# Altium project p0001.PrjPcb
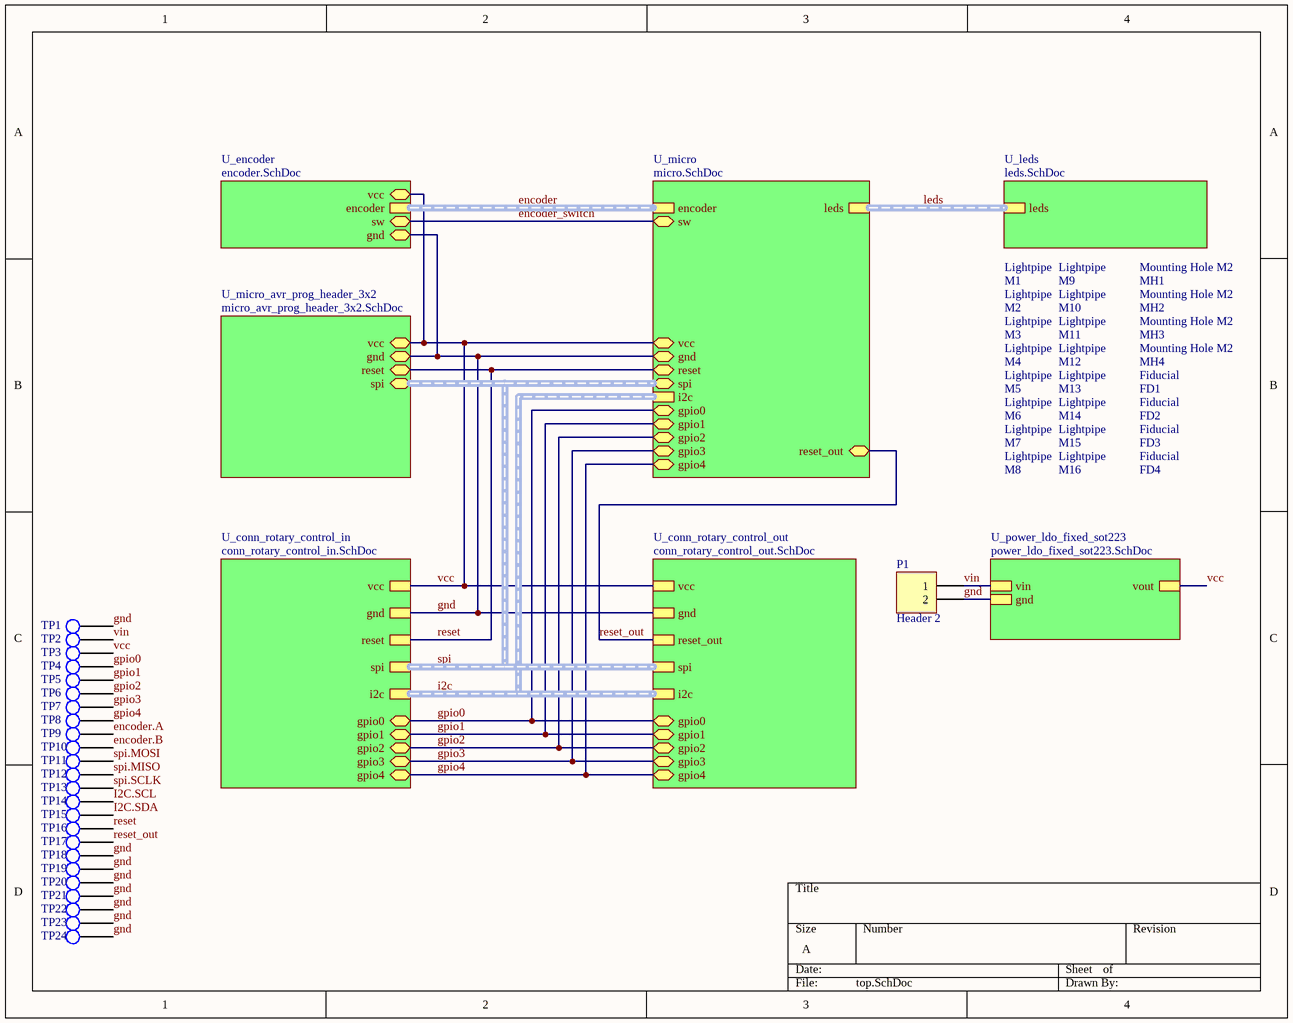
[diagram p0: top.SchDoc]
9 sheets, 97 parts. Net scope: strictly hierarchical (ports join the sheet entries above them; power ports are local).
Board file: PCB1.PcbDoc
Sheets:
  top.SchDoc
    U_encoder = encoder.SchDoc
    U_leds = leds.SchDoc
    U_micro = micro.SchDoc
      U_micro_avr_tiny_48_88_tqfp32 = micro_avr_tiny_48_88_tqfp32.SchDoc
    U_micro_avr_prog_header_3x2 = micro_avr_prog_header_3x2.SchDoc
    U_conn_rotary_control_in = conn_rotary_control_in.SchDoc
    U_conn_rotary_control_out = conn_rotary_control_out.SchDoc
    U_power_ldo_fixed_sot223 = power_ldo_fixed_sot223.SchDoc

## Sheet top.SchDoc
size A

### Parts
(Parts that share a designator on the sheet are numbered #1, #2 ... from top to bottom, then left to right.)
FD1  Component_1  [PCBComponent_1]  (value not drawn)
FD2  Component_1  [PCBComponent_1]  (value not drawn)
FD3  Component_1  [PCBComponent_1]  (value not drawn)
FD4  Component_1  [PCBComponent_1]  (value not drawn)
M1  Component_1  [PCBComponent_1]  (value not drawn)
M2  Component_1  [PCBComponent_1]  (value not drawn)
M3  Component_1  [PCBComponent_1]  (value not drawn)
M4  Component_1  [PCBComponent_1]  (value not drawn)
M5  Component_1  [PCBComponent_1]  (value not drawn)
M6  Component_1  [PCBComponent_1]  (value not drawn)
M7  Component_1  [PCBComponent_1]  (value not drawn)
M8  Component_1  [PCBComponent_1]  (value not drawn)
M9  Component_1  [PCBComponent_1]  (value not drawn)
M10  Component_1  [PCBComponent_1]  (value not drawn)
M11  Component_1  [PCBComponent_1]  (value not drawn)
M12  Component_1  [PCBComponent_1]  (value not drawn)
M13  Component_1  [PCBComponent_1]  (value not drawn)
M14  Component_1  [PCBComponent_1]  (value not drawn)
M15  Component_1  [PCBComponent_1]  (value not drawn)
M16  Component_1  [PCBComponent_1]  (value not drawn)
MH1  Component_1  [PCBComponent_1]  (value not drawn)
MH2  Component_1  [PCBComponent_1]  (value not drawn)
MH3  Component_1  [PCBComponent_1]  (value not drawn)
MH4  Component_1  [PCBComponent_1]  (value not drawn)
P1#1  Header 2  [HDR1X2]
TP1#1  Component_1  [PCBComponent_1]  (value not drawn)
TP2#1  Component_1  [PCBComponent_1]  (value not drawn)
TP3#1  Component_1  [PCBComponent_1]  (value not drawn)
TP4#1  Component_1  [PCBComponent_1]  (value not drawn)
TP5#1  Component_1  [PCBComponent_1]  (value not drawn)
TP6  Component_1  [PCBComponent_1]  (value not drawn)
TP7  Component_1  [PCBComponent_1]  (value not drawn)
TP8  Component_1  [PCBComponent_1]  (value not drawn)
TP9  Component_1  [PCBComponent_1]  (value not drawn)
TP10  Component_1  [PCBComponent_1]  (value not drawn)
TP11  Component_1  [PCBComponent_1]  (value not drawn)
TP12  Component_1  [PCBComponent_1]  (value not drawn)
TP13  Component_1  [PCBComponent_1]  (value not drawn)
TP14  Component_1  [PCBComponent_1]  (value not drawn)
TP15  Component_1  [PCBComponent_1]  (value not drawn)
TP16  Component_1  [PCBComponent_1]  (value not drawn)
TP17  Component_1  [PCBComponent_1]  (value not drawn)
TP18  Component_1  [PCBComponent_1]  (value not drawn)
TP19  Component_1  [PCBComponent_1]  (value not drawn)
TP20  Component_1  [PCBComponent_1]  (value not drawn)
TP21  Component_1  [PCBComponent_1]  (value not drawn)
TP22  Component_1  [PCBComponent_1]  (value not drawn)
TP23  Component_1  [PCBComponent_1]  (value not drawn)
TP24  Component_1  [PCBComponent_1]  (value not drawn)

### Sub-sheets
U_conn_rotary_control_in = conn_rotary_control_in.SchDoc: vcc, gnd, reset, spi (harness Spi_t), i2c (harness I2c_t), gpio0, gpio1, gpio2, gpio3, gpio4
U_conn_rotary_control_out = conn_rotary_control_out.SchDoc: vcc, gnd, reset_out, spi (harness Spi_t), i2c (harness I2c_t), gpio0, gpio1, gpio2, gpio3, gpio4
U_encoder = encoder.SchDoc: encoder (harness encoder_t), gnd, sw, vcc
U_leds = leds.SchDoc: leds (harness Array_4x4_t)
U_micro = micro.SchDoc: leds (harness Array_4x4_t), encoder (harness Encoder_t), i2c (harness i2c_t), vcc, gnd, reset, spi (harness Spi_t), reset_out, gpio0, gpio1, gpio2, gpio3, gpio4, sw
U_micro_avr_prog_header_3x2 = micro_avr_prog_header_3x2.SchDoc: vcc, reset, gnd, spi (harness Spi_t)
U_power_ldo_fixed_sot223 = power_ldo_fixed_sot223.SchDoc: gnd, vin, vout

### Nets
encoder.A: TP9.1
encoder.B: TP10.1
encoder_switch: sheet U_encoder/sw, sheet U_micro/sw
gnd: P1#1.2 TP1#1.1 TP18.1 TP19.1 TP20.1 TP21.1 TP22.1 TP23.1 TP24.1 ; sheet U_encoder/gnd, sheet U_micro/gnd, sheet U_micro_avr_prog_header_3x2/gnd, sheet U_conn_rotary_control_in/gnd, sheet U_conn_rotary_control_out/gnd, sheet U_power_ldo_fixed_sot223/gnd
gpio0: TP4#1.1 ; sheet U_micro/gpio0, sheet U_conn_rotary_control_in/gpio0, sheet U_conn_rotary_control_out/gpio0
gpio1: TP5#1.1 ; sheet U_micro/gpio1, sheet U_conn_rotary_control_in/gpio1, sheet U_conn_rotary_control_out/gpio1
gpio2: TP6.1 ; sheet U_micro/gpio2, sheet U_conn_rotary_control_in/gpio2, sheet U_conn_rotary_control_out/gpio2
gpio3: TP7.1 ; sheet U_micro/gpio3, sheet U_conn_rotary_control_in/gpio3, sheet U_conn_rotary_control_out/gpio3
gpio4: TP8.1 ; sheet U_micro/gpio4, sheet U_conn_rotary_control_in/gpio4, sheet U_conn_rotary_control_out/gpio4
I2C.SCL: TP14.1
I2C.SDA: TP15.1
reset: TP16.1 ; sheet U_micro/reset, sheet U_micro_avr_prog_header_3x2/reset, sheet U_conn_rotary_control_in/reset
reset_out: TP17.1 ; sheet U_micro/reset_out, sheet U_conn_rotary_control_out/reset_out
spi.MISO: TP12.1
spi.MOSI: TP11.1
spi.SCLK: TP13.1
vcc: TP3#1.1 ; sheet U_encoder/vcc, sheet U_micro/vcc, sheet U_micro_avr_prog_header_3x2/vcc, sheet U_conn_rotary_control_in/vcc, sheet U_conn_rotary_control_out/vcc, sheet U_power_ldo_fixed_sot223/vout
vin: P1#1.1 TP2#1.1 ; sheet U_power_ldo_fixed_sot223/vin

### Buses and harness runs
harness encoder = sheet U_encoder/encoder = sheet U_micro/encoder
harness i2c = sheet U_conn_rotary_control_in/i2c = sheet U_conn_rotary_control_out/i2c = sheet U_micro/i2c
harness leds = sheet U_leds/leds = sheet U_micro/leds
harness spi = sheet U_conn_rotary_control_in/spi = sheet U_conn_rotary_control_out/spi = sheet U_micro/spi = sheet U_micro_avr_prog_header_3x2/spi

### Notes on the sheet
- (in symbol Component_1) Lightpipe; Mounting Hole M2; Fiducial

### Library data of the parts
M1-M16 = Component_1: Light Pipe Vertical; ManufacturerPartNumber: VLP-350-F; Manufacturer: Bivar
P1#1 = Header 2: Header, 2-Pin; LatestRevisionDate: 17-Jul-2002; LatestRevisionNote: Re-released for DXP Platform.; Publisher: Altium Limited

## Sheet encoder.SchDoc
size A
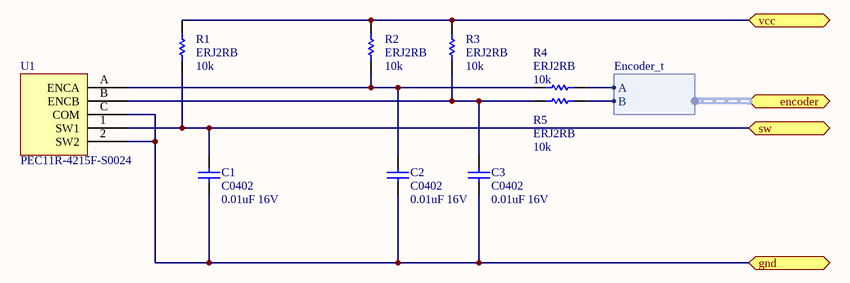
[diagram p1: encoder.SchDoc]

### Parts
(Parts that share a designator on the sheet are numbered #1, #2 ... from top to bottom, then left to right.)
C1#1  C0402  value 0.01uF 16V  [0402]
C2#1  C0402  value 0.01uF 16V  [0402]
C3#1  C0402  value 0.01uF 16V  [0402]
R1#1  ERJ2RB  value 10k  [2-0402]
R2#1  ERJ2RB  value 10k  [2-0402]
R3#1  ERJ2RB  value 10k  [2-0402]
R4#1  ERJ2RB  value 10k  [2-0402]
R5  ERJ2RB  value 10k  [2-0402]
U1#1  PEC11R-4215F-S0024  [PCBComponent_1]

### Ports
encoder (harness Encoder_t), gnd, sw, vcc

### Harnesses
Encoder_t: A, B

### Nets
encoder.A: R4#1.1 ; port encoder.A
encoder.B: R5.1 ; port encoder.B
encoder_switch: C1#1.1 R1#1.1 U1#1.1(SW1) ; port sw
gnd: C1#1.2 C2#1.2 C3#1.2 U1#1.2(SW2) U1#1.C(COM) ; port gnd
vcc: R1#1.2 R2#1.2 R3#1.2 ; port vcc
NetC2#1_1: C2#1.1 R2#1.1 R4#1.2 U1#1.A(ENCA)
NetC3#1_1: C3#1.1 R3#1.1 R5.2 U1#1.B(ENCB)

### Library data of the parts
C1#1 C2#1 C3#1 = C0402: Ceramic Chip Capacitor - Standard; Note: Footprint corresponds to dimensions for bulk cassette packaging. This case size has tightened tolerances.; Published: 17-Jul-2002; LatestRevisionDate: 19-Mar-2004; LatestRevisionNote: Silkscreen size reduced.; DatasheetDocument: Mar-2001; PackageDocument: Mar-2001; PackageReference: 0402; Publisher: Altium Limited; Code_JEITA: 0402; Code_IPC: 1005 [0402]; ComponentLink1Description: Manufacturer Link; ComponentLink1URL: http://www.kemet.com/; ComponentLink2Description: Datasheet; ComponentLink2URL: http://www.kemet.com/kemet/web/homepage/kechome.nsf/vapubfilesname/F3102TA.pdf/$file/F3102TA.pdf
R1#1 R2#1 R3#1 R4#1 R5 = ERJ2RB: Precision Thick Film Chip Resistor, 10 Ohm to 1M Ohm Range, 1% and 0.5% Tolerance, 0402 Size, 0.063 W; Published: 17-Dec-2003; LatestRevisionDate: 19-Mar-2004; LatestRevisionNote: Silkscreen size reduced.; PackageDocument: Mar-2003; PackageReference: 2-0402; Publisher: Altium Limited; Code_IPC: 1005 [0402]; ComponentLink1Description: Manufacturer Link; ComponentLink1URL: http://www.panasonic.com/industrial/components/resistive_products.htm; ComponentLink2Description: Datasheet; ComponentLink2URL: http://www.panasonic.com/industrial/components/pdf/AOA0000CE2.pdf
U1#1 = Component_1: PEC11R-4xxxF-Sxxxx; Manufacturer: Bourns; ManufacturerPartNumber: PEC11R-4215F-S0024

## Sheet leds.SchDoc
size A
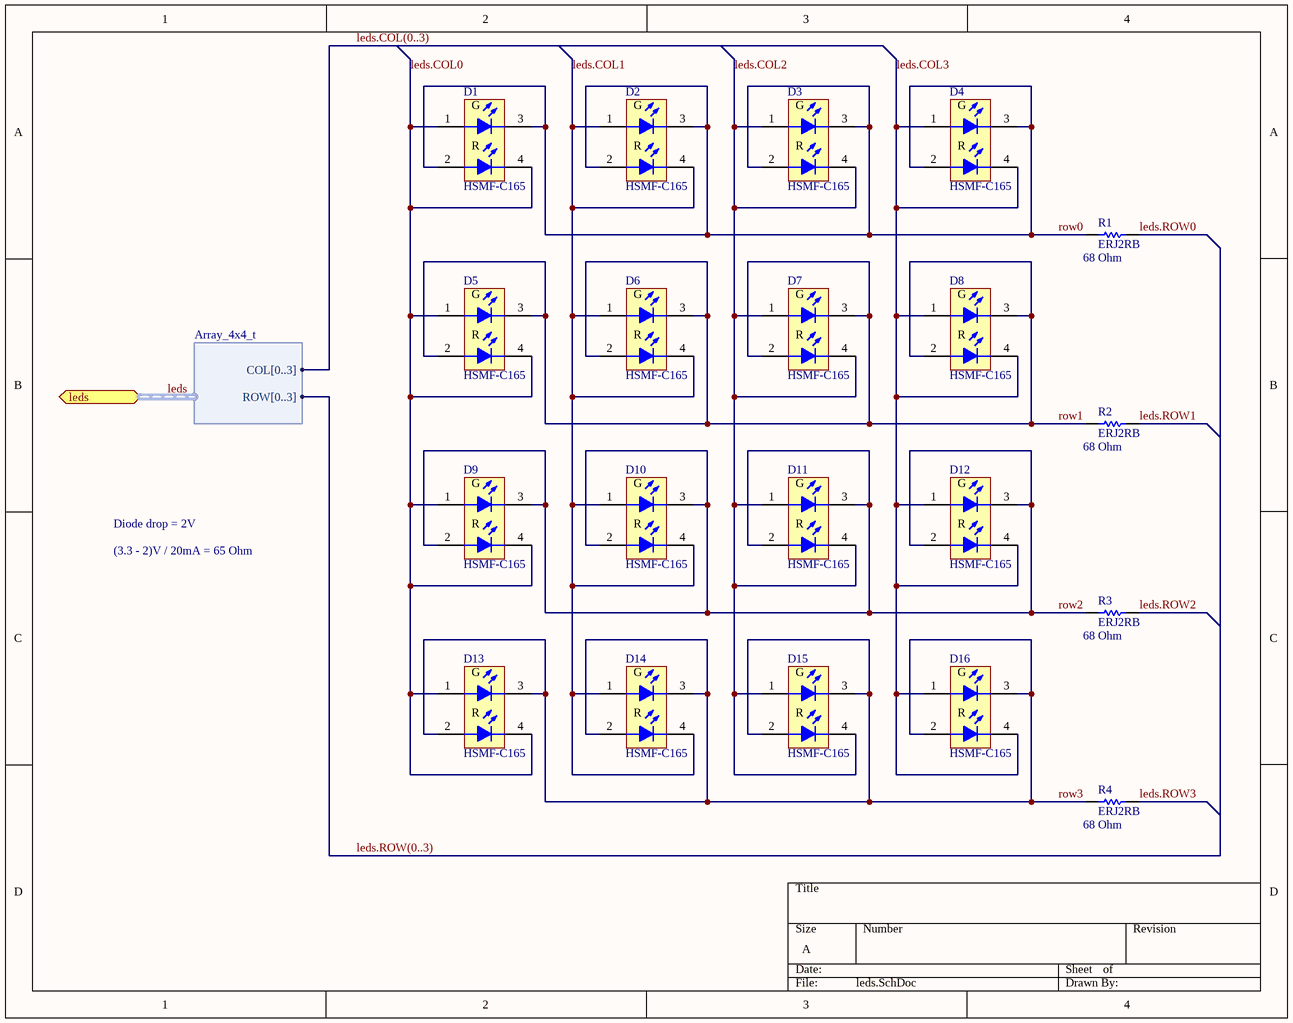
[diagram p2: leds.SchDoc]

### Parts
(Parts that share a designator on the sheet are numbered #1, #2 ... from top to bottom, then left to right.)
D1  HSMF-C165  [1.6X0.8X0.5]
D2  HSMF-C165  [1.6X0.8X0.5]
D3  HSMF-C165  [1.6X0.8X0.5]
D4  HSMF-C165  [1.6X0.8X0.5]
D5  HSMF-C165  [1.6X0.8X0.5]
D6  HSMF-C165  [1.6X0.8X0.5]
D7  HSMF-C165  [1.6X0.8X0.5]
D8  HSMF-C165  [1.6X0.8X0.5]
D9  HSMF-C165  [1.6X0.8X0.5]
D10  HSMF-C165  [1.6X0.8X0.5]
D11  HSMF-C165  [1.6X0.8X0.5]
D12  HSMF-C165  [1.6X0.8X0.5]
D13  HSMF-C165  [1.6X0.8X0.5]
D14  HSMF-C165  [1.6X0.8X0.5]
D15  HSMF-C165  [1.6X0.8X0.5]
D16  HSMF-C165  [1.6X0.8X0.5]
R1#2  ERJ2RB  value 68 Ohm  [2-0402]
R2#2  ERJ2RB  value 68 Ohm  [2-0402]
R3#2  ERJ2RB  value 68 Ohm  [2-0402]
R4#2  ERJ2RB  value 68 Ohm  [2-0402]

### Ports
leds (harness Array_4x4_t)

### Harnesses
Array_4x4_t: ROW[0..3], COL[0..3]

### Nets
leds.COL0: D1.1(A1) D1.4(K2) D5.1(A1) D5.4(K2) D9.1(A1) D9.4(K2) D13.1(A1) D13.4(K2)
leds.COL1: D2.1(A1) D2.4(K2) D6.1(A1) D6.4(K2) D10.1(A1) D10.4(K2) D14.1(A1) D14.4(K2)
leds.COL2: D3.1(A1) D3.4(K2) D7.1(A1) D7.4(K2) D11.1(A1) D11.4(K2) D15.1(A1) D15.4(K2)
leds.COL3: D4.1(A1) D4.4(K2) D8.1(A1) D8.4(K2) D12.1(A1) D12.4(K2) D16.1(A1) D16.4(K2)
leds.ROW0: R1#2.1
leds.ROW1: R2#2.1
leds.ROW2: R3#2.1
leds.ROW3: R4#2.1
row0: D1.2(A2) D1.3(K1) D2.2(A2) D2.3(K1) D3.2(A2) D3.3(K1) D4.2(A2) D4.3(K1) R1#2.2
row1: D5.2(A2) D5.3(K1) D6.2(A2) D6.3(K1) D7.2(A2) D7.3(K1) D8.2(A2) D8.3(K1) R2#2.2
row2: D9.2(A2) D9.3(K1) D10.2(A2) D10.3(K1) D11.2(A2) D11.3(K1) D12.2(A2) D12.3(K1) R3#2.2
row3: D13.2(A2) D13.3(K1) D14.2(A2) D14.3(K1) D15.2(A2) D15.3(K1) D16.2(A2) D16.3(K1) R4#2.2

### Buses and harness runs
bus leds.COL(0..3)
bus leds.ROW(0..3)
harness leds = port leds

### Notes on the sheet
- Diode drop = 2V
- (3.3 - 2)V / 20mA = 65 Ohm
- (in symbol HSMF-C165) G; R

### Library data of the parts
D1-D16 = HSMF-C165: Miniature Bi-Colour Surface Mount Chip LED (Red/Green); LuminousIntensity: 2.5mcd (Minimum).; LED_Colour: Red & Green; PCB_Layout: Complies with manufacturer's recommendation.; Published: 11-Dec-2002; DatasheetVersion: 6-Apr-2002; PackageVersion: 6-Apr-2002; PackageReference: 1.6X0.8X0.5; Publisher: Altium Limited; PackageDescription: SM LED, Bi-Colour; 4 Flat Leads; Body 1.6 x 0.8 x 0.5 mm (LxWxH); ComponentLink1Description: Manufacturer Link; ComponentLink1URL: http://www.avagotech.com/; ComponentLink2Description: Datasheet; ComponentLink2URL: http://cp.literature.agilent.com/litweb/pdf/5988-6146EN.pdf
R1#2 R2#2 R3#2 R4#2 = ERJ2RB: as R1#1 on sheet encoder; Published: 17-Dec-2003; LatestRevisionDate: 19-Mar-2004; LatestRevisionNote: Silkscreen size reduced.; PackageDocument: Mar-2003; PackageReference: 2-0402; Publisher: Altium Limited; Code_IPC: 1005 [0402]; ComponentLink1Description: Manufacturer Link; ComponentLink1URL: http://www.panasonic.com/industrial/components/resistive_products.htm; ComponentLink2Description: Datasheet; ComponentLink2URL: http://www.panasonic.com/industrial/components/pdf/AOA0000CE2.pdf

## Sheet micro.SchDoc
size A
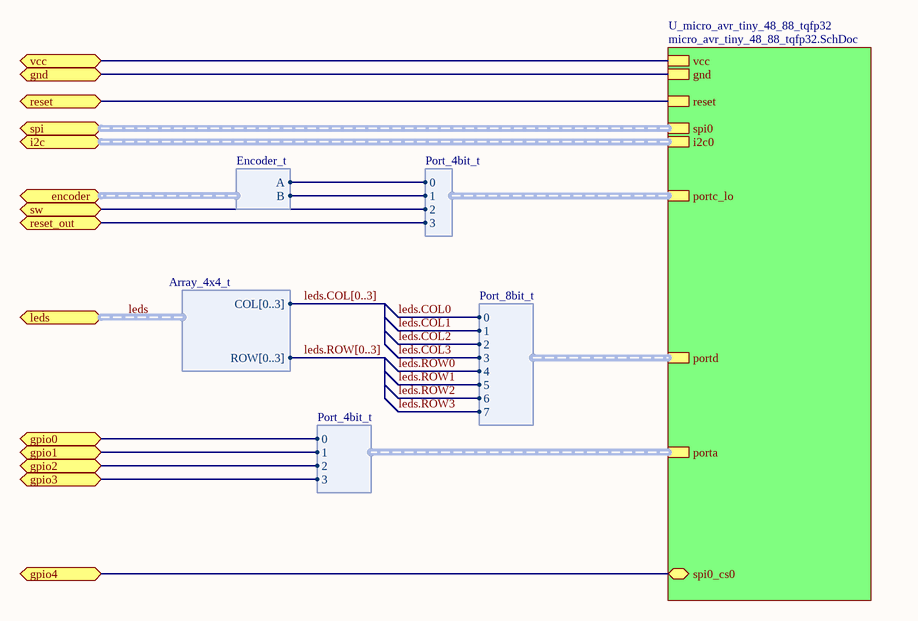
[diagram p3: micro.SchDoc]

### Sub-sheets
U_micro_avr_tiny_48_88_tqfp32 = micro_avr_tiny_48_88_tqfp32.SchDoc: vcc, gnd, spi0 (harness Spi_t), reset, portc_lo (harness Port_4bit_t), i2c0 (harness I2c_t), portd (harness Port_8bit_t), porta (harness Port_4bit_t), spi0_cs0

### Ports
encoder (harness Encoder_t), gnd, gpio0, gpio1, gpio2, gpio3, gpio4, i2c (harness i2c_t), leds (harness Array_4x4_t), reset, reset_out, spi (harness Spi_t), sw, vcc

### Harnesses
Encoder_t: A, B
Port_4bit_t: 0, 1, 2, 3
Port_8bit_t: 0, 1, 2, 3, 4, 5, 6, 7
Array_4x4_t: COL[0..3], ROW[0..3]

### Nets
encoder.A: port encoder.A, sheet U_micro_avr_tiny_48_88_tqfp32/portc_lo.0
encoder.B: port encoder.B, sheet U_micro_avr_tiny_48_88_tqfp32/portc_lo.1
encoder_switch: port sw, sheet U_micro_avr_tiny_48_88_tqfp32/portc_lo.2
gnd: port gnd, sheet U_micro_avr_tiny_48_88_tqfp32/gnd
gpio0: port gpio0, sheet U_micro_avr_tiny_48_88_tqfp32/porta.0
gpio1: port gpio1, sheet U_micro_avr_tiny_48_88_tqfp32/porta.1
gpio2: port gpio2, sheet U_micro_avr_tiny_48_88_tqfp32/porta.2
gpio3: port gpio3, sheet U_micro_avr_tiny_48_88_tqfp32/porta.3
gpio4: port gpio4, sheet U_micro_avr_tiny_48_88_tqfp32/spi0_cs0
reset: port reset, sheet U_micro_avr_tiny_48_88_tqfp32/reset
reset_out: port reset_out, sheet U_micro_avr_tiny_48_88_tqfp32/portc_lo.3
vcc: port vcc, sheet U_micro_avr_tiny_48_88_tqfp32/vcc

### Buses and harness runs
bus leds.COL[0..3]
bus leds.ROW[0..3]
harness leds = port leds
harness port i2c = sheet U_micro_avr_tiny_48_88_tqfp32/i2c0
harness port spi = sheet U_micro_avr_tiny_48_88_tqfp32/spi0

## Sheet micro_avr_tiny_48_88_tqfp32.SchDoc
size A
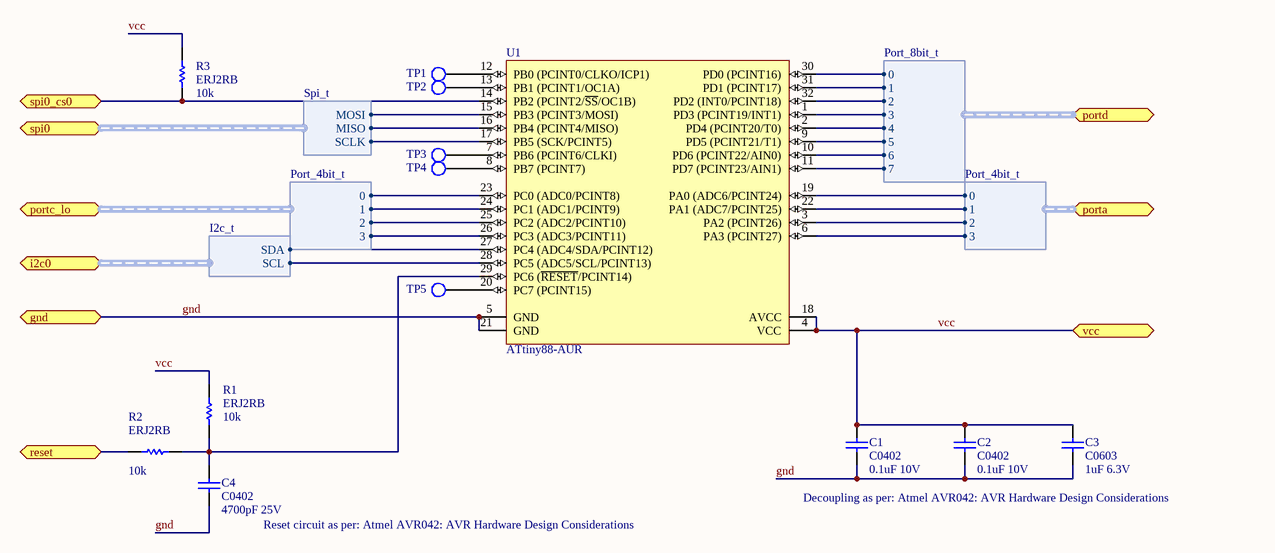
[diagram p4: micro_avr_tiny_48_88_tqfp32.SchDoc]

### Parts
(Parts that share a designator on the sheet are numbered #1, #2 ... from top to bottom, then left to right.)
C1#2  C0402  value 0.1uF 10V  [0402]
C2#2  C0402  value 0.1uF 10V  [0402]
C3#2  C0603  value 1uF 6.3V  [0603]
C4  C0402  value 4700pF 25V  [0402]
R1#3  ERJ2RB  value 10k  [2-0402]
R2#3  ERJ2RB  value 10k  [2-0402]
R3#3  ERJ2RB  value 10k  [2-0402]
TP1#2  Component_1  [PCBComponent_1]  (value not drawn)
TP2#2  Component_1  [PCBComponent_1]  (value not drawn)
TP3#2  Component_1  [PCBComponent_1]  (value not drawn)
TP4#2  Component_1  [PCBComponent_1]  (value not drawn)
TP5#2  Component_1  [PCBComponent_1]  (value not drawn)
U1#2  ATtiny88-AUR  [32A_N]

### Ports
gnd, i2c0 (harness I2c_t), porta (harness Port_4bit_t), portc_lo (harness Port_4bit_t), portd (harness Port_8bit_t), reset, spi0 (harness Spi_t), spi0_cs0, vcc

### Harnesses
Port_4bit_t: 0, 1, 2, 3
I2c_t: SDA, SCL
Port_8bit_t: 0, 1, 2, 3, 4, 5, 6, 7
Spi_t: MISO, MOSI, SCLK

### Nets
encoder.A: U1#2.23(PC0_(ADC0/PCINT8)) ; port portc_lo.0
encoder.B: U1#2.24(PC1_(ADC1/PCINT9)) ; port portc_lo.1
encoder_switch: U1#2.25(PC2_(ADC2/PCINT10)) ; port portc_lo.2
gnd: C1#2.2 C2#2.2 C3#2.1 C4.2 U1#2.5(GND) U1#2.21(GND) ; port gnd
gpio0: U1#2.19(PA0_(ADC6/PCINT24)) ; port porta.0
gpio1: U1#2.22(PA1_(ADC7/PCINT25)) ; port porta.1
gpio2: U1#2.3(PA2_(PCINT26)) ; port porta.2
gpio3: U1#2.6(PA3_(PCINT27)) ; port porta.3
gpio4: R3#3.1 U1#2.14(PB2_(PCINT2/~{SS}/OC1B)) ; port spi0_cs0
i2c.SCL: U1#2.28(PC5_(ADC5/SCL/PCINT13)) ; port i2c0.SCL
i2c.SDA: U1#2.27(PC4_(ADC4/SDA/PCINT12)) ; port i2c0.SDA
leds.COL0: U1#2.30(PD0_(PCINT16)) ; port portd.0
leds.COL1: U1#2.31(PD1_(PCINT17)) ; port portd.1
leds.COL2: U1#2.32(PD2_(INT0/PCINT18)) ; port portd.2
leds.COL3: U1#2.1(PD3_(PCINT19/INT1)) ; port portd.3
leds.ROW0: U1#2.2(PD4_(PCINT20/T0)) ; port portd.4
leds.ROW1: U1#2.9(PD5_(PCINT21/T1)) ; port portd.5
leds.ROW2: U1#2.10(PD6_(PCINT22/AIN0)) ; port portd.6
leds.ROW3: U1#2.11(PD7_(PCINT23/AIN1)) ; port portd.7
reset: R2#3.2 ; port reset
reset_out: U1#2.26(PC3_(ADC3/PCINT11)) ; port portc_lo.3
spi.MISO: U1#2.16(PB4_(PCINT4/MISO)) ; port spi0.MISO
spi.MOSI: U1#2.15(PB3_(PCINT3/MOSI)) ; port spi0.MOSI
spi.SCLK: U1#2.17(PB5_(SCK/PCINT5)) ; port spi0.SCLK
vcc: C1#2.1 C2#2.1 C3#2.2 R1#3.2 R3#3.2 U1#2.4(VCC) U1#2.18(AVCC) ; port vcc
NetC4_1: C4.1 R1#3.1 R2#3.1 U1#2.29(PC6_(~{RESET}/PCINT14))
NetTP1#2_1: TP1#2.1 U1#2.12(PB0_(PCINT0/CLKO/ICP1))
NetTP2#2_1: TP2#2.1 U1#2.13(PB1_(PCINT1/OC1A))
NetTP3#2_1: TP3#2.1 U1#2.7(PB6_(PCINT6/CLKI))
NetTP4#2_1: TP4#2.1 U1#2.8(PB7_(PCINT7))
NetTP5#2_1: TP5#2.1 U1#2.20(PC7_(PCINT15))

### Notes on the sheet
- Decoupling as per: Atmel AVR042: AVR Hardware Design Considerations
- Reset circuit as per: Atmel AVR042: AVR Hardware Design Considerations

### Library data of the parts
C1#2 C2#2 C4 = C0402: as C1#1 on sheet encoder; Published: 17-Jul-2002; LatestRevisionDate: 19-Mar-2004; LatestRevisionNote: Silkscreen size reduced.; DatasheetDocument: Mar-2001; PackageDocument: Mar-2001; PackageReference: 0402; Publisher: Altium Limited; Code_JEITA: 0402; Code_IPC: 1005 [0402]; ComponentLink1Description: Manufacturer Link; ComponentLink1URL: http://www.kemet.com/; ComponentLink2Description: Datasheet; ComponentLink2URL: http://www.kemet.com/kemet/web/homepage/kechome.nsf/vapubfilesname/F3102TA.pdf/$file/F3102TA.pdf
C3#2 = C0603: Ceramic Chip Capacitor - Standard; Note: Footprint corresponds to dimensions for bulk cassette packaging. This case size has tightened tolerances.; Published: 17-Jul-2002; LatestRevisionDate: 19-Mar-2004; LatestRevisionNote: Silkscreen size reduced.; DatasheetDocument: Mar-2001; PackageDocument: Mar-2001; PackageReference: 0603; Publisher: Altium Limited; Code_JEITA: 0603; Code_IPC: 1608 [0603]; ComponentLink1Description: Manufacturer Link; ComponentLink1URL: http://www.kemet.com/; ComponentLink2Description: Datasheet; ComponentLink2URL: http://www.kemet.com/kemet/web/homepage/kechome.nsf/vapubfilesname/F3102TA.pdf/$file/F3102TA.pdf
R1#3 R2#3 R3#3 = ERJ2RB: as R1#1 on sheet encoder; Published: 17-Dec-2003; LatestRevisionDate: 19-Mar-2004; LatestRevisionNote: Silkscreen size reduced.; PackageDocument: Mar-2003; PackageReference: 2-0402; Publisher: Altium Limited; Code_IPC: 1005 [0402]; ComponentLink1Description: Manufacturer Link; ComponentLink1URL: http://www.panasonic.com/industrial/components/resistive_products.htm; ComponentLink2Description: Datasheet; ComponentLink2URL: http://www.panasonic.com/industrial/components/pdf/AOA0000CE2.pdf
U1#2 = ATtiny88-AUR: 8-bit AVR Microcontroller, 1.8-5.5V, 12MHz, 8KB Flash, 64 Bytes EEPROM, 512 Bytes SRAM, 32-pin TQFP, Industrial Grade (-40°C to 85°C), Pb-Free, Reel; DatasheetVersion: revC, Mar-2009; PackageVersion: revC, Oct-2010; PackageReference: 32A; PackageDescription: 32-Lead, 7x7x1.0 mm Body, 0.8mm Lead Pitch, Thin Profile Plastic Quad Flat Package (TQFP); Code_JEDEC: MS-026-ABA; ComponentLink1Description: Manufacturer URL; ComponentLink1URL: http://www.atmel.com/; ComponentLink2Description: ATtiny48/88 Datasheet; ComponentLink2URL: http://www.atmel.com/dyn/resources/prod_documents/doc8008.pdf; ComponentLink3Description: ATtiny48/88 Summary; ComponentLink3URL: http://www.atmel.com/dyn/resources/prod_documents/8008S.pdf

## Sheet micro_avr_prog_header_3x2.SchDoc
size A
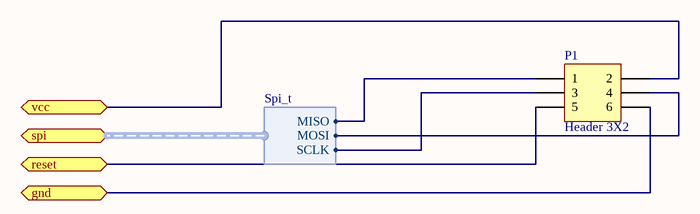
[diagram p5: micro_avr_prog_header_3x2.SchDoc]

### Parts
(Parts that share a designator on the sheet are numbered #1, #2 ... from top to bottom, then left to right.)
P1#2  Header 3X2  [HDR2X3]

### Ports
gnd, reset, spi (harness Spi_t), vcc

### Harnesses
Spi_t: MISO, MOSI, SCLK

### Nets
gnd: P1#2.6 ; port gnd
reset: P1#2.5 ; port reset
spi.MISO: P1#2.1 ; port spi.MISO
spi.MOSI: P1#2.4 ; port spi.MOSI
spi.SCLK: P1#2.3 ; port spi.SCLK
vcc: P1#2.2 ; port vcc

### Library data of the parts
P1#2 = Header 3X2: Header, 3-Pin, Dual row; LatestRevisionDate: 17-Jul-2002; LatestRevisionNote: Re-released for DXP Platform.; Publisher: Altium Limited

## Sheet conn_rotary_control_in.SchDoc
size A
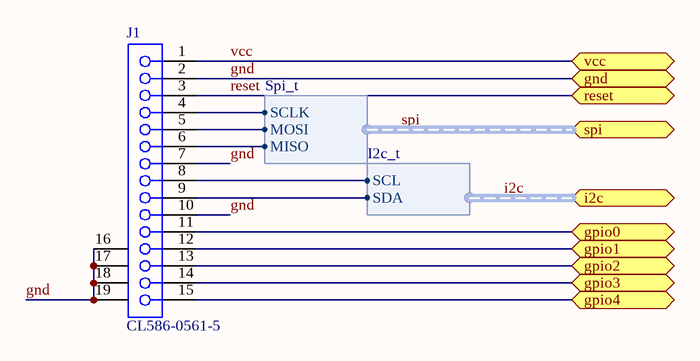
[diagram p6: conn_rotary_control_in.SchDoc]

### Parts
(Parts that share a designator on the sheet are numbered #1, #2 ... from top to bottom, then left to right.)
J1#1  CL586-0561-5  [FH12-15S-0.5SV]

### Ports
gnd, gpio0, gpio1, gpio2, gpio3, gpio4, i2c (harness I2c_t), reset, spi (harness Spi_t), vcc

### Harnesses
Spi_t: MISO, MOSI, SCLK
I2c_t: SCL, SDA

### Nets
gnd: J1#1.2 J1#1.7 J1#1.10 J1#1.16(MH1) J1#1.17(MH2) J1#1.18(MH3) J1#1.19(MH4) ; port gnd
gpio0: J1#1.11 ; port gpio0
gpio1: J1#1.12 ; port gpio1
gpio2: J1#1.13 ; port gpio2
gpio3: J1#1.14 ; port gpio3
gpio4: J1#1.15 ; port gpio4
i2c.SCL: J1#1.8 ; port i2c.SCL
i2c.SDA: J1#1.9 ; port i2c.SDA
reset: J1#1.3 ; port reset
spi.MISO: J1#1.6 ; port spi.MISO
spi.MOSI: J1#1.5 ; port spi.MOSI
spi.SCLK: J1#1.4 ; port spi.SCLK
vcc: J1#1.1 ; port vcc

### Buses and harness runs
harness i2c = port i2c
harness spi = port spi

### Library data of the parts
J1#1 = CL586-0561-5: FH12 Series, "Flip-Lock" SMT/ZIF FFC/FPC Connector - 0.5mm Spaced Vertical Mounting; Manufacturer: Hirose; ManufacturerPartNumber: FH12-15S-0.5SV(55); Positions: 15; ContactMaterial: Phosphor Bronze; Current: 0.4A; PCB_Layout: Complies with manufacturer's recommendation.; Note: Pad dimensions follow nominal values, Suitable for Wave Soldering, Adjust for Re-flow.; Published: 17-Jul-2002; DatasheetVersion: 13-Nov-2000; PackageVersion: 13-Nov-2000; PackageReference: FH12-15S-0.5SV; Publisher: Altium Limited; ComponentLink1Description: Manufacturer Link; ComponentLink1URL: http://www.hiroseusa.com/; ComponentLink2Description: Datasheet; ComponentLink2URL: http://www.hirose.co.jp/cataloge_hp/e58605370.pdf

## Sheet conn_rotary_control_out.SchDoc
size A
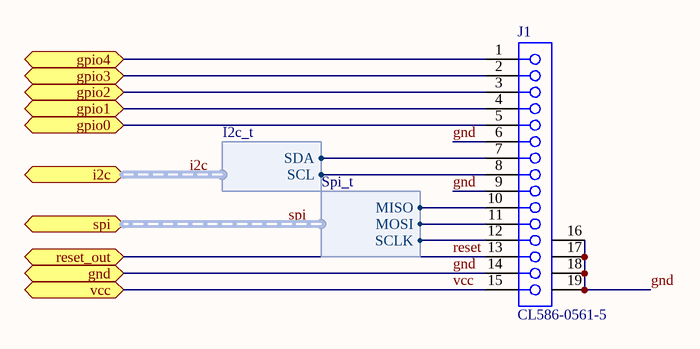
[diagram p7: conn_rotary_control_out.SchDoc]

### Parts
(Parts that share a designator on the sheet are numbered #1, #2 ... from top to bottom, then left to right.)
J1#2  CL586-0561-5  [FH12-15S-0.5SV]

### Ports
gnd, gpio0, gpio1, gpio2, gpio3, gpio4, i2c (harness I2c_t), reset_out, spi (harness Spi_t), vcc

### Harnesses
Spi_t: MISO, MOSI, SCLK
I2c_t: SCL, SDA

### Nets
gnd: J1#2.6 J1#2.9 J1#2.14 J1#2.16(MH1) J1#2.17(MH2) J1#2.18(MH3) J1#2.19(MH4) ; port gnd
gpio0: J1#2.5 ; port gpio0
gpio1: J1#2.4 ; port gpio1
gpio2: J1#2.3 ; port gpio2
gpio3: J1#2.2 ; port gpio3
gpio4: J1#2.1 ; port gpio4
i2c.SCL: J1#2.8 ; port i2c.SCL
i2c.SDA: J1#2.7 ; port i2c.SDA
reset: J1#2.13 ; port reset_out  [project net reset_out]
spi.MISO: J1#2.10 ; port spi.MISO
spi.MOSI: J1#2.11 ; port spi.MOSI
spi.SCLK: J1#2.12 ; port spi.SCLK
vcc: J1#2.15 ; port vcc

### Buses and harness runs
harness i2c = port i2c
harness spi = port spi

### Library data of the parts
J1#2 = CL586-0561-5: as J1#1 on sheet conn_rotary_control_in; Published: 17-Jul-2002; DatasheetVersion: 13-Nov-2000; PackageVersion: 13-Nov-2000; PackageReference: FH12-15S-0.5SV; Publisher: Altium Limited; ComponentLink1Description: Manufacturer Link; ComponentLink1URL: http://www.hiroseusa.com/; ComponentLink2Description: Datasheet; ComponentLink2URL: http://www.hirose.co.jp/cataloge_hp/e58605370.pdf

## Sheet power_ldo_fixed_sot223.SchDoc
size A
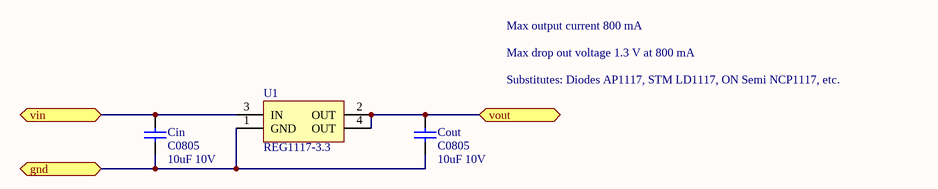
[diagram p8: power_ldo_fixed_sot223.SchDoc]

### Parts
(Parts that share a designator on the sheet are numbered #1, #2 ... from top to bottom, then left to right.)
Cin  C0805  value 10uF 10V  [0805]
Cout  C0805  value 10uF 10V  [0805]
U1#3  REG1117-3.3  [ZZ311]

### Ports
gnd, vin, vout

### Nets
gnd: Cin.2 Cout.2 U1#3.1(GND) ; port gnd
vcc: Cout.1 U1#3.2(OUT) U1#3.4(OUT) ; port vout
vin: Cin.1 U1#3.3(IN) ; port vin

### Notes on the sheet
- Max drop out voltage 1.3 V at 800 mA
- Max output current 800 mA
- Substitutes: Diodes AP1117, STM LD1117, ON Semi NCP1117, etc.

### Library data of the parts
Cin Cout = C0805: Ceramic Chip Capacitor - Standard; Note: Footprint corresponds to dimensions for bulk cassette packaging. This case size has tightened tolerances.; Published: 17-Jul-2002; LatestRevisionDate: 19-Mar-2004; LatestRevisionNote: Silkscreen size reduced.; DatasheetDocument: Mar-2001; PackageDocument: Mar-2001; PackageReference: 0805; Publisher: Altium Limited; Code_JEITA: 0805; Code_IPC: 2012[0805]; ComponentLink1Description: Manufacturer Link; ComponentLink1URL: http://www.kemet.com/; ComponentLink2Description: Datasheet; ComponentLink2URL: http://www.kemet.com/kemet/web/homepage/kechome.nsf/vapubfilesname/F3102TA.pdf/$file/F3102TA.pdf
U1#3 = REG1117-3.3: 800mA and 1A Low Dropout Positive Regulator 2.85V, 3.3V, 5V, and Adjustable; Manufacturer: Texas Instruments; ManufacturerPartNumber: REG1117-3.3/2K5; Published: 8-Jun-2000; LatestRevisionDate: 17-Jul-2002; LatestRevisionNote: Re-released for DXP Platform.; DatasheetVersion: Sep-1997; PackageVersion: revC; PackageReference: ZZ311; Publisher: Altium Limited; PackageDescription: SOT-223/SC-73; 4 Leads; Body 6.7 x 7.3 mm, inc. leads (LxW max); ComponentLink1Description: Manufacturer Link; ComponentLink1URL: http://www.ti.com/; ComponentLink2Description: Datasheet; ComponentLink2URL: http://www-s.ti.com/sc/ds/REG1117.pdf

## Nets that join several sheets
encoder.A: encoder (R4#1.1), micro_avr_tiny_48_88_tqfp32 (U1#2.23)
encoder.B: encoder (R5.1), micro_avr_tiny_48_88_tqfp32 (U1#2.24)
encoder_switch: encoder (C1#1.1 R1#1.1 U1#1.1), micro_avr_tiny_48_88_tqfp32 (U1#2.25)
gnd: top (9 pins), encoder (5 pins), micro_avr_tiny_48_88_tqfp32 (6 pins), micro_avr_prog_header_3x2 (P1#2.6), conn_rotary_control_in (7 pins), conn_rotary_control_out (7 pins), power_ldo_fixed_sot223 (Cin.2 Cout.2 U1#3.1)
gpio0: top (TP4#1.1), micro_avr_tiny_48_88_tqfp32 (U1#2.19), conn_rotary_control_in (J1#1.11), conn_rotary_control_out (J1#2.5)
gpio1: top (TP5#1.1), micro_avr_tiny_48_88_tqfp32 (U1#2.22), conn_rotary_control_in (J1#1.12), conn_rotary_control_out (J1#2.4)
gpio2: top (TP6.1), micro_avr_tiny_48_88_tqfp32 (U1#2.3), conn_rotary_control_in (J1#1.13), conn_rotary_control_out (J1#2.3)
gpio3: top (TP7.1), micro_avr_tiny_48_88_tqfp32 (U1#2.6), conn_rotary_control_in (J1#1.14), conn_rotary_control_out (J1#2.2)
gpio4: top (TP8.1), micro_avr_tiny_48_88_tqfp32 (R3#3.1 U1#2.14), conn_rotary_control_in (J1#1.15), conn_rotary_control_out (J1#2.1)
i2c.SCL: micro_avr_tiny_48_88_tqfp32 (U1#2.28), conn_rotary_control_in (J1#1.8), conn_rotary_control_out (J1#2.8)
i2c.SDA: micro_avr_tiny_48_88_tqfp32 (U1#2.27), conn_rotary_control_in (J1#1.9), conn_rotary_control_out (J1#2.7)
reset: top (TP16.1), micro_avr_tiny_48_88_tqfp32 (R2#3.2), micro_avr_prog_header_3x2 (P1#2.5), conn_rotary_control_in (J1#1.3)
reset_out: top (TP17.1), micro_avr_tiny_48_88_tqfp32 (U1#2.26), conn_rotary_control_out (J1#2.13)
spi.MISO: micro_avr_tiny_48_88_tqfp32 (U1#2.16), micro_avr_prog_header_3x2 (P1#2.1), conn_rotary_control_in (J1#1.6), conn_rotary_control_out (J1#2.10)
spi.MOSI: micro_avr_tiny_48_88_tqfp32 (U1#2.15), micro_avr_prog_header_3x2 (P1#2.4), conn_rotary_control_in (J1#1.5), conn_rotary_control_out (J1#2.11)
spi.SCLK: micro_avr_tiny_48_88_tqfp32 (U1#2.17), micro_avr_prog_header_3x2 (P1#2.3), conn_rotary_control_in (J1#1.4), conn_rotary_control_out (J1#2.12)
vcc: top (TP3#1.1), encoder (R1#1.2 R2#1.2 R3#1.2), micro_avr_tiny_48_88_tqfp32 (7 pins), micro_avr_prog_header_3x2 (P1#2.2), conn_rotary_control_in (J1#1.1), conn_rotary_control_out (J1#2.15), power_ldo_fixed_sot223 (Cout.1 U1#3.2 U1#3.4)
vin: top (P1#1.1 TP2#1.1), power_ldo_fixed_sot223 (Cin.1 U1#3.3)

## Assembly variants
Variant of p0001: not fitted FD1.1 FD2.1 FD3.1 FD4.1 MH1.1 MH2.1 MH3.1 MH4.1 TP1.1 TP1.7 TP2.1 TP2.7 TP3.1 TP3.7 TP4.1 TP4.7 TP5.1 TP5.7 TP6.1 TP7.1 TP8.1 TP9.1 TP10.1 TP11.1 TP12.1 TP13.1 TP14.1 TP15.1 TP16.1 TP17.1 TP18.1 TP19.1 TP20.1 TP21.1 TP22.1 TP23.1 TP24.1